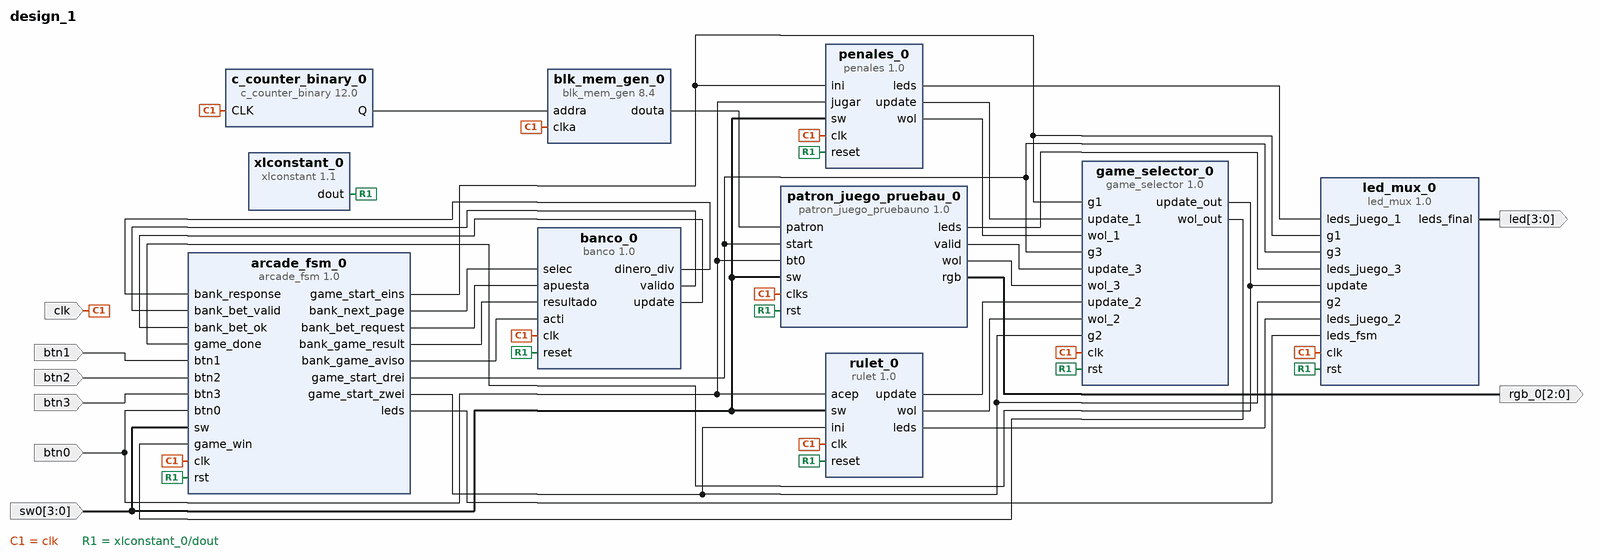
[diagram p0: block diagram of the top level]
# Vivado block design design_1, xc7z010clg400-1, Vivado 2020.1
create_bd_design design_1

create_bd_port -dir I -type clk clk
create_bd_port -dir I btn0
create_bd_port -dir I btn1
create_bd_port -dir I btn2
create_bd_port -dir I btn3
create_bd_port -dir I -from 3 -to 0 sw0
create_bd_port -dir O -from 3 -to 0 led
create_bd_port -dir O -from 2 -to 0 rgb_0

create_bd_cell -type ip -vlnv xilinx.com:ip:xlconstant:1.1 xlconstant_0
set_property -dict {CONFIG.CONST_VAL 0 CONFIG.CONST_WIDTH 1} [get_bd_cells xlconstant_0]
create_bd_cell -type ip -vlnv xilinx.com:user:led_mux:1.0 led_mux_0
create_bd_cell -type ip -vlnv xilinx.com:user:rulet:1.0 rulet_0
create_bd_cell -type ip -vlnv xilinx.com:user:arcade_fsm:1.0 arcade_fsm_0
create_bd_cell -type ip -vlnv xilinx.com:user:banco:1.0 banco_0
create_bd_cell -type ip -vlnv xilinx.com:ip:blk_mem_gen:8.4 blk_mem_gen_0
set_property -dict [list \
  CONFIG.Coe_File ../../../../../../../../Downloads/casos.coe \
  CONFIG.Enable_32bit_Address false \
  CONFIG.Enable_A Always_Enabled \
  CONFIG.Load_Init_File true \
  CONFIG.Memory_Type Single_Port_ROM \
  CONFIG.Port_A_Write_Rate 0 \
  CONFIG.Register_PortA_Output_of_Memory_Primitives true \
  CONFIG.Use_RSTA_Pin false \
  CONFIG.Write_Depth_A 32 \
  CONFIG.Write_Width_A 8 \
  CONFIG.use_bram_block Stand_Alone \
] [get_bd_cells blk_mem_gen_0]
create_bd_cell -type ip -vlnv xilinx.com:ip:c_counter_binary:12.0 c_counter_binary_0
set_property -dict {CONFIG.Output_Width 5} [get_bd_cells c_counter_binary_0]
create_bd_cell -type ip -vlnv xilinx.com:user:game_selector:1.0 game_selector_0
create_bd_cell -type ip -vlnv xilinx.com:user:patron_juego_pruebauno:1.0 patron_juego_pruebau_0
create_bd_cell -type ip -vlnv xilinx.com:user:penales:1.0 penales_0

# ---- connections ----

connect_bd_net [get_bd_pins arcade_fsm_0/bank_next_page] [get_bd_pins banco_0/selec]
connect_bd_net [get_bd_pins arcade_fsm_0/bank_bet_request] [get_bd_pins banco_0/apuesta]
connect_bd_net [get_bd_pins arcade_fsm_0/bank_game_result] [get_bd_pins banco_0/resultado]
connect_bd_net [get_bd_pins arcade_fsm_0/game_start_eins] [get_bd_pins led_mux_0/g1] [get_bd_pins game_selector_0/g1] [get_bd_pins penales_0/ini]
connect_bd_net [get_bd_pins banco_0/dinero_div] [get_bd_pins arcade_fsm_0/bank_response]
connect_bd_net [get_bd_pins banco_0/valido] [get_bd_pins arcade_fsm_0/bank_bet_valid]
connect_bd_net [get_bd_pins banco_0/update] [get_bd_pins arcade_fsm_0/bank_bet_ok]
connect_bd_net [get_bd_pins arcade_fsm_0/game_start_zwei] [get_bd_pins led_mux_0/g2] [get_bd_pins rulet_0/ini] [get_bd_pins game_selector_0/g2]
connect_bd_net [get_bd_pins penales_0/update] [get_bd_pins game_selector_0/update_1]
connect_bd_net [get_bd_pins penales_0/wol] [get_bd_pins game_selector_0/wol_1]
connect_bd_net -net game_selector_0_game_done_out [get_bd_pins game_selector_0/update_out] \
  [get_bd_pins led_mux_0/update] [get_bd_pins arcade_fsm_0/game_done]
connect_bd_net -net game_selector_0_game_win_out [get_bd_pins game_selector_0/wol_out] [get_bd_pins arcade_fsm_0/game_win]
connect_bd_net -net clk_0_1 [get_bd_ports clk] \
  [get_bd_pins led_mux_0/clk] [get_bd_pins rulet_0/clk] [get_bd_pins arcade_fsm_0/clk] [get_bd_pins banco_0/clk] \
  [get_bd_pins c_counter_binary_0/CLK] [get_bd_pins blk_mem_gen_0/clka] [get_bd_pins game_selector_0/clk] \
  [get_bd_pins patron_juego_pruebau_0/clks] [get_bd_pins penales_0/clk]
connect_bd_net -net btn1_0_1 [get_bd_ports btn1] [get_bd_pins arcade_fsm_0/btn1]
connect_bd_net -net btn2_0_1 [get_bd_ports btn2] [get_bd_pins arcade_fsm_0/btn2]
connect_bd_net [get_bd_pins penales_0/leds] [get_bd_pins led_mux_0/leds_juego_1]
connect_bd_net [get_bd_pins rulet_0/leds] [get_bd_pins led_mux_0/leds_juego_2]
connect_bd_net [get_bd_pins arcade_fsm_0/leds] [get_bd_pins led_mux_0/leds_fsm]
connect_bd_net [get_bd_pins led_mux_0/leds_final] [get_bd_ports led]
connect_bd_net [get_bd_pins rulet_0/update] [get_bd_pins game_selector_0/update_2]
connect_bd_net -net btn0_1 [get_bd_ports btn0] \
  [get_bd_pins arcade_fsm_0/btn0] [get_bd_pins rulet_0/acep] [get_bd_pins patron_juego_pruebau_0/bt0] \
  [get_bd_pins penales_0/jugar]
connect_bd_net [get_bd_pins arcade_fsm_0/game_start_drei] \
  [get_bd_pins led_mux_0/g3] [get_bd_pins game_selector_0/g3] [get_bd_pins patron_juego_pruebau_0/start]
connect_bd_net [get_bd_pins rulet_0/wol] [get_bd_pins game_selector_0/wol_2]
connect_bd_net [get_bd_pins arcade_fsm_0/bank_game_aviso] [get_bd_pins banco_0/acti]
connect_bd_net [get_bd_pins c_counter_binary_0/Q] [get_bd_pins blk_mem_gen_0/addra]
connect_bd_net [get_bd_pins xlconstant_0/dout] \
  [get_bd_pins arcade_fsm_0/rst] [get_bd_pins banco_0/reset] [get_bd_pins rulet_0/reset] [get_bd_pins led_mux_0/rst] \
  [get_bd_pins game_selector_0/rst] [get_bd_pins patron_juego_pruebau_0/rst] [get_bd_pins penales_0/reset]
connect_bd_net -net sw0_1 [get_bd_ports sw0] \
  [get_bd_pins arcade_fsm_0/sw] [get_bd_pins rulet_0/sw] [get_bd_pins patron_juego_pruebau_0/sw] [get_bd_pins penales_0/sw]
connect_bd_net [get_bd_pins blk_mem_gen_0/douta] [get_bd_pins patron_juego_pruebau_0/patron]
connect_bd_net [get_bd_pins patron_juego_pruebau_0/leds] [get_bd_pins led_mux_0/leds_juego_3]
connect_bd_net [get_bd_pins patron_juego_pruebau_0/valid] [get_bd_pins game_selector_0/update_3]
connect_bd_net -net patron_juego_pruebau_0_done [get_bd_pins patron_juego_pruebau_0/wol] [get_bd_pins game_selector_0/wol_3]
connect_bd_net [get_bd_pins patron_juego_pruebau_0/rgb] [get_bd_ports rgb_0]
connect_bd_net -net btn3_1 [get_bd_ports btn3] [get_bd_pins arcade_fsm_0/btn3]

validate_bd_design
save_bd_design
